# EAGLE design polar_bear (EAGLE 6.1)
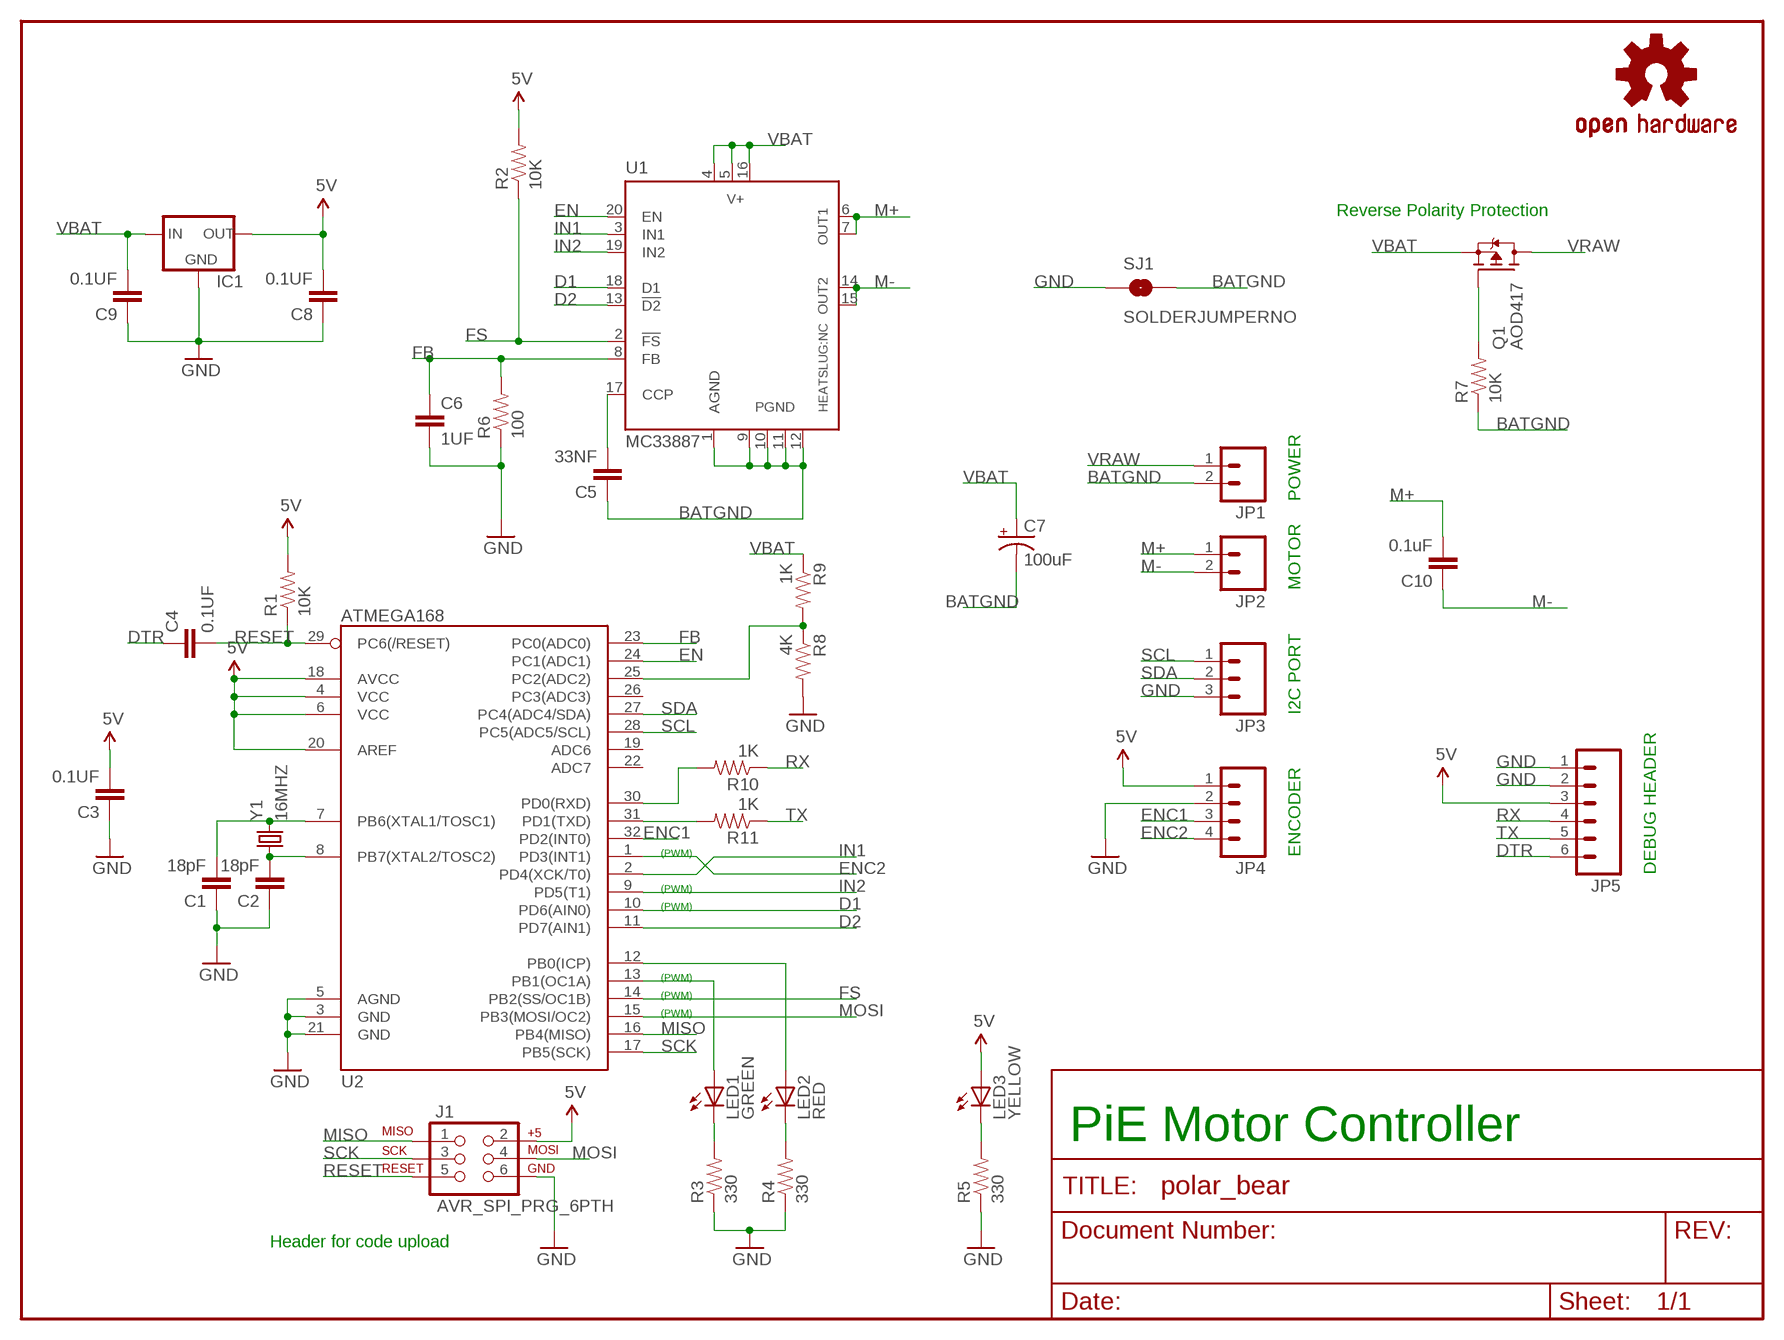
[diagram p0: schematic, sheet 1]

## Parts
C1  18pF  CAP0805  [0805]
C2  18pF  CAP0805  [0805]
C3  0.1UF  CAP0805  [0805]
C4  0.1UF  CAP0805  [0805]
C5  33NF  CAP0805  [0805]
C6  1UF  CAP0805  [0805]
C7  100uF  CAP_POLPTH1  [CPOL-RADIAL-100UF-25V]
C8  0.1UF  CAP0805  [0805]
C9  0.1UF  CAP0805  [0805]
C10  0.1uF  CAP0805  [0805]
IC1  V_REG_78XXTO-92  [TO-92]
J1  AVR_SPI_PRG_6PTH  [2X3]
JP1  M02PTH4  [1X02_XTRA_BIG]
JP2  M02PTH4  [1X02_XTRA_BIG]
JP3  M03POLAR  [MOLEX-1X3]
JP4  M04POLAR  [MOLEX-1X4]
JP5  M06SIP  [1X06]
LED1  GREEN  LED1206  [LED-1206]
LED2  RED  LED1206  [LED-1206]
LED3  YELLOW  LED1206  [LED-1206]
Q1  AOD417  [TO252]
R1  10K  RESISTOR0805-RES  [0805]
R2  10K  RESISTOR0805-RES  [0805]
R3  330  RESISTOR0805-RES  [0805]
R4  330  RESISTOR0805-RES  [0805]
R5  330  RESISTOR0805-RES  [0805]
R6  100  RESISTOR0805-RES  [0805]
R7  10K  RESISTOR0805-RES  [0805]
R8  4K  RESISTOR0805-RES  [0805]
R9  1K  RESISTOR0805-RES  [0805]
R10  1K  RESISTOR0805-RES  [0805]
R11  1K  RESISTOR0805-RES  [0805]
SJ1  SOLDERJUMPERNO  [SJ_2S-NO]
U1  MC33887  [HSOP-20]
U2  ATMEGA168  [TQFP32-08]
U$12  OSHW-LOGOS  [OSHW-LOGO-S]
Y1  16MHZ  CRYSTALHC49US  [HC49US]

## Nets
5V: C3.2 C8.2 IC1.3(OUT) J1.2 JP4.1 JP5.3 LED3.A R1.2 R2.2 U2.4(VCC) U2.6(VCC) U2.18(AVCC) U2.20(AREF)
BATGND: C5.1 C7.2(-) JP1.2 R7.1 SJ1.2 U1.1(AGND) U1.9(PGND) U1.10(PGND) U1.11(PGND) U1.12(PGND)
D1: U1.18(D1) U2.10(PD6(AIN0))
D2: U1.13(!D2) U2.11(PD7(AIN1))
DTR: C4.1 JP5.6
EN: U1.20(EN) U2.24(PC1(ADC1))
ENC1: JP4.3 U2.32(PD2(INT0))
ENC2: JP4.4 U2.1(PD3(INT1))
FB: C6.1 R6.2 U1.8(FB) U2.23(PC0(ADC0))
FS: R2.1 U1.2(!FS) U2.14(PB2(SS/OC1B))
GND: C1.1 C2.1 C3.1 C6.2 C8.1 C9.1 IC1.1(GND) J1.6 JP3.3 JP4.2 JP5.1 JP5.2 R3.1 R4.1 R5.1 R6.1 R8.2 SJ1.1 U2.3(GND) U2.5(AGND) U2.21(GND)
IN1: U1.3(IN1) U2.2(PD4(XCK/T0))
IN2: U1.19(IN2) U2.9(PD5(T1))
M+: C10.2 JP2.1 U1.6(OUT1) U1.7(OUT1)
M-: C10.1 JP2.2 U1.14(OUT2) U1.15(OUT2)
MISO: J1.1 U2.16(PB4(MISO))
MOSI: J1.4 U2.15(PB3(MOSI/OC2))
N$1: LED1.A U2.13(PB1(OC1A))
N$2: C2.2 U2.8(PB7(XTAL2/TOSC2)) Y1.1
N$3: C1.2 U2.7(PB6(XTAL1/TOSC1)) Y1.2
N$4: LED2.A U2.12(PB0(ICP))
N$5: LED1.C R3.2
N$6: LED2.C R4.2
N$7: C5.2 U1.17(CCP)
N$8: Q1.1(G) R7.2
N$9: LED3.C R5.2
N$10: R8.1 R9.2 U2.25(PC2(ADC2))
N$13: R11.2 U2.31(PD1(TXD))
N$14: R10.2 U2.30(PD0(RXD))
RESET: C4.2 J1.5 R1.1 U2.29(PC6(/RESET))
RX: JP5.4 R10.1
SCK: J1.3 U2.17(PB5(SCK))
SCL: JP3.1 U2.28(PC5(ADC5/SCL))
SDA: JP3.2 U2.27(PC4(ADC4/SDA))
TX: JP5.5 R11.1
VBAT: C7.1(+) C9.2 IC1.2(IN) Q1.2(S) R9.1 U1.4(V+) U1.5(V+) U1.16(V+)
VRAW: JP1.1 Q1.3(D)
Unconnected: U2.19(ADC6) U2.22(ADC7) U2.26(PC3(ADC3))

## Notes on the sheet
- Reverse Polarity Protection
- POWER
- MOTOR
- I2C PORT
- (PWM) | ENCODER
- DEBUG HEADER
- (PWM)
- (PWM)
- (PWM)
- (PWM)
- (PWM)
- PiE Motor Controller
- Header for code upload

## Library data of the parts
C1-C6 C8-C10 = SparkFun:CAP: Capacitor Standard 0603 ceramic capacitor, and 0.1" leaded capacitor.
C7 = SparkFun:CAP_POL: Capacitor Polarized These are standard SMD and PTH capacitors. Normally 10uF, 47uF, and 100uF in electrolytic and tantalum varieties. Always verify the external diameter of the through hole cap, it varies with capacity, voltage, and manufacturer. The EIA devices should be standard.
IC1 = SparkFun:V_REG_78XX: Voltage Regulator Standard 7805 5V regulator. IGO (Input Ground Output). Spark Fun Electronics SKU : COM-00107
J1 = SparkFun:AVR_SPI_PRG_6: AVR ISP 6 Pin This is the reduced ISP connector for AVR programming. Common on Arduino. This footprint will take up less PCB space and can be used with a 10-pin to 6-pin adapter such as SKU: BOB-08508
JP1 JP2 = SparkFun:M02: Header 2 Standard 2-pin 0.1" header. Use with straight break away headers (SKU : PRT-00116), right angle break away headers (PRT-00553), swiss pins (PRT-00743), machine pins (PRT-00117), and female headers (PRT-00115). Molex polarized connector foot print use with SKU : PRT-08233 with associated crimp pins and housings.
JP3 = SparkFun:M03: Header 3 Standard 3-pin 0.1" header. Use with straight break away headers (SKU : PRT-00116), right angle break away headers (PRT-00553), swiss pins (PRT-00743), machine pins (PRT-00117), and female headers (PRT-00115). Molex polarized connector foot print use with SKU : PRT-08232 with associated crimp pins and housings.
JP4 = SparkFun:M04: Header 4 Standard 4-pin 0.1" header. Use with straight break away headers (SKU : PRT-00116), right angle break away headers (PRT-00553), swiss pins (PRT-00743), machine pins (PRT-00117), and female headers (PRT-00115). Molex polarized connector foot print use with SKU : PRT-08231 with associated crimp pins and housings. 1MM SMD Version SKU: PRT-10208
JP5 = SparkFun:M06: Header 6 Standard 6-pin 0.1" header. Use with straight break away headers (SKU : PRT-00116), right angle break away headers (PRT-00553), swiss pins (PRT-00743), machine pins (PRT-00117), and female headers (PRT-00115). Molex polarized connector foot print use with SKU : PRT-08094 with associated crimp pins and housings. NOTES ON THE VARIANTS LOCK and LOCK_LONGPADS... This footprint was designed to help hold the alignment of a through-hole component (i.e. 6-pin header) while soldering it into place. You may notice that each hole has been shifted either up or down by 0.005 of an inch from it's more standard position (which is a perfectly straight line). This slight alteration caused the pins (the squares in the middle) to touch the edges of the holes. Because they are alternating, it causes a "brace" to hold the component in place. 0.005 has proven to be the perfect amount of "off-center" position when using our standard breakaway headers. Although looks a little odd when you look at the bare footprint, once you have a header in there, the alteration is very hard to notice. Also, if you push a header all the way into place, it is covered up entirely on the bottom side. This idea of altering the position of holes to aid alignment will be further integrated into the Sparkfun Library for other footprints. It can help hold any component with 3 or more connection pins.
LED1-LED3 = SparkFun:LED: LEDs Standard schematic elements and footprints for 5mm, 3mm, 1206, and 0603 sized LEDs. 5mm - Spark Fun Electronics SKU : COM-00529 (and others)
Q1 = transistor-fet:AOD417
R1-R11 = SparkFun:RESISTOR: Resistor Basic schematic elements and footprints for 0603, 1206, and PTH resistors.
SJ1 = SparkFun:SOLDERJUMPER: Solder Jumper Standard SMD solder jumper. Used to automate production. Two varients : Normally Open and Normally Closed are the same, but have different paste layers. NC will have a large amount of paste and should jumper during reflow.
U1 = pie:MC33887: 5.0A H-Bridge with Load Current Feedback Source: http://www.freescale.com/files/analog/doc/data_sheet/MC33887.pdf
U2 = SparkFun:ATMEGA168
U$12 = SparkFun:OSHW-LOGO: Open Source Hardware Logo This logo indicates the piece of hardware it is found on incorporates a OSHW license and/or adheres to the definition of open source hardware found here: http://freedomdefined.org/OSHW
Y1 = SparkFun:CRYSTAL: Crystals Various standard crystals. Proven footprints. Spark Fun Electronics SKU : COM-00534

## Board
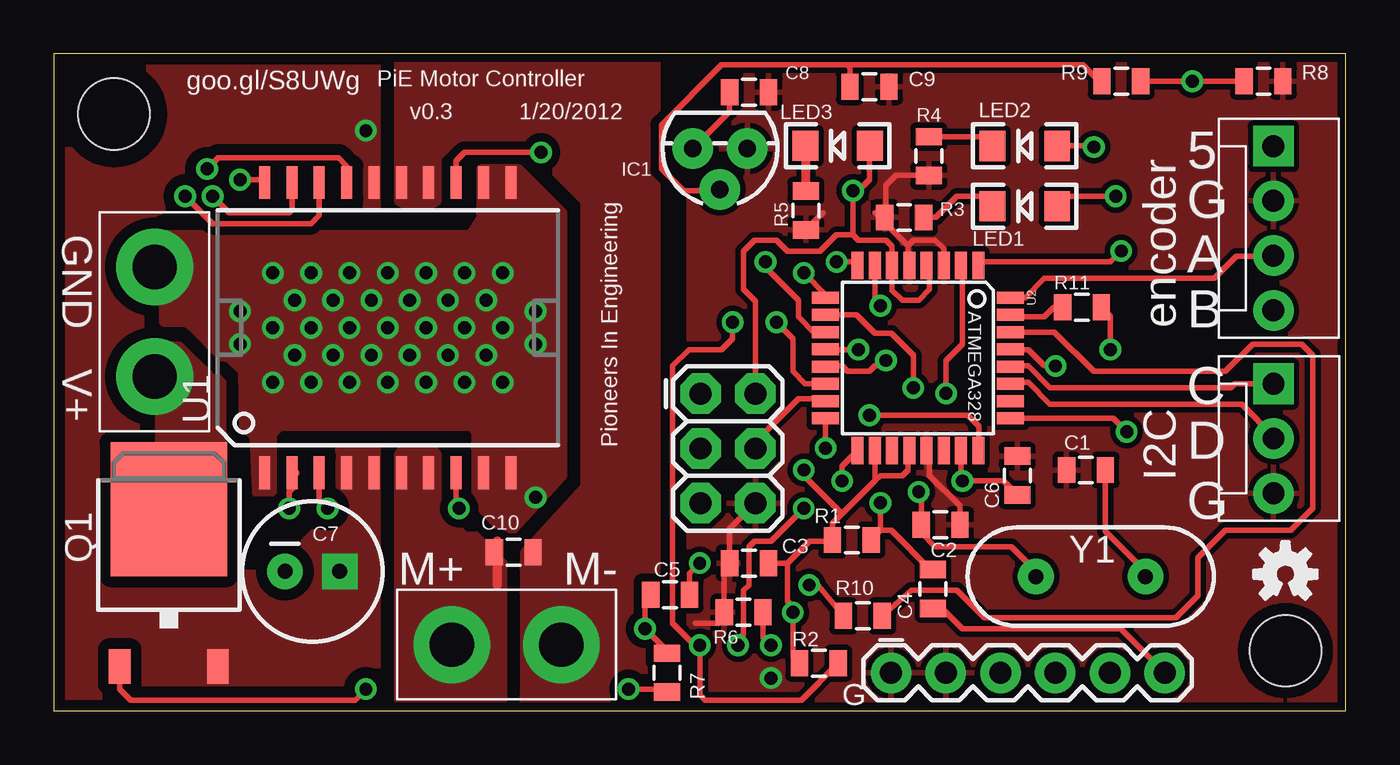
[diagram p1: board, top side]
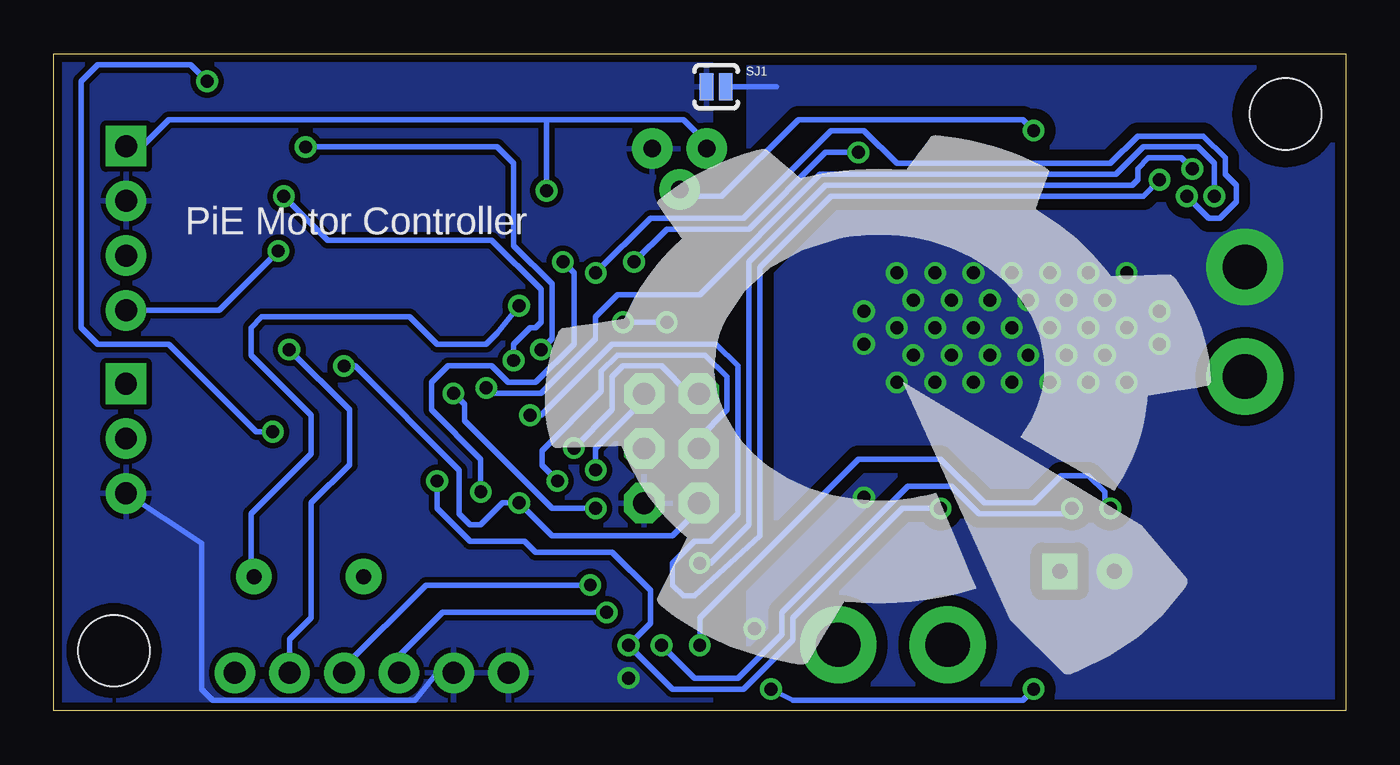
[diagram p2: board, bottom side, seen from below]

Size 59.94 x 30.48 mm. Coordinates in mm from the lower left corner, seen from the top.
Outline: 0,0 59.94,0 59.94,30.48 0,30.48 0,0
Copper layers (1*16): Top 0.035559375mm / dielectric 1.501140625mm / Bottom 0.035559375mm
Design rules: minimum track width 10mil, minimum drill 15mil, track to track 6mil, track to pad 6mil, pad to pad 6mil, via to via 6mil, smd to smd 6mil, copper to edge 15mil, drill to drill 8mil, minimum pad ring 10mil, minimum via ring 8mil, stop-mask expansion 4mil, vias tented up to drill 0mil, thermal gap 10mil

### Footprints (pad centres in the part's own frame; a part is rotated, then mirrored left to right if it is on the bottom)
0805 = smd 0.8 x 1.2: 1 -0.9,0; 2 0.9,0
CPOL-RADIAL-100UF-25V = drill 0.7 pad 1.651 square: 1 1.27,0 | drill 0.7 pad 1.651: 2 -1.27,0
TO-92 = drill 0.813 pad 1.88: 1 -1.27,0; 2 0,1.905; 3 1.27,0
2X3 = drill 1.016 pad 1.88 octagon: 1 0,0; 2 0,2.54; 3 2.54,0; 4 2.54,2.54; 5 5.08,0; 6 5.08,2.54
1X02_XTRA_BIG = drill 2.057 pad 3.556: 1 -2.54,0; 2 2.54,0
MOLEX-1X3 = drill 1.016 pad 1.88 square: 1 0,0 | drill 1.016 pad 1.88: 2 2.54,0; 3 5.08,0
MOLEX-1X4 = drill 1.016 pad 1.88 square: 1 0,0 | drill 1.016 pad 1.88: 2 2.54,0; 3 5.08,0; 4 7.62,0
1X06 = drill 1.016 pad 1.88: 1 0,0; 2 2.54,0; 3 5.08,0; 4 7.62,0; 5 10.16,0; 6 12.7,0
LED-1206 = smd 1.2 x 1.4: A -1.5,0; C 1.5,0
TO252 = smd 1 x 1.6: 1 -2.28,-4.8; 2 2.28,-4.8 | smd 5.4 x 6.2: 3 0,2.5
SJ_2S-NO = smd 0.635 x 1.27: 1 -0.45,0; 2 0.45,0
HSOP-20 = smd 0.508 x 1.524: 1 -5.715,-6.731; 2 -4.445,-6.731; 3 -3.175,-6.731; 4 -1.905,-6.731; 5 -0.635,-6.731; 6 0.635,-6.731; 7 1.905,-6.731; 8 3.175,-6.731; 9 4.445,-6.731; 10 5.715,-6.731; 11 5.715,6.731; 12 4.445,6.731; 13 3.175,6.731; 14 1.905,6.731; 15 0.635,6.731; 16 -0.635,6.731; 17 -1.905,6.731; 18 -3.175,6.731; 19 -4.445,6.731; 20 -5.715,6.731
TQFP32-08 = smd 1.27 x 0.559: 1 -4.293,2.8; 2 -4.293,2; 3 -4.293,1.2; 4 -4.293,0.4; 5 -4.293,-0.4; 6 -4.293,-1.2; 7 -4.293,-2; 8 -4.293,-2.8; 17 4.293,-2.8; 18 4.293,-2; 19 4.293,-1.2; 20 4.293,-0.4; 21 4.293,0.4; 22 4.293,1.2; 23 4.293,2; 24 4.293,2.8 | smd 0.559 x 1.27: 9 -2.8,-4.293; 10 -2,-4.293; 11 -1.2,-4.293; 12 -0.4,-4.293; 13 0.4,-4.293; 14 1.2,-4.293; 15 2,-4.293; 16 2.8,-4.293; 25 2.8,4.293; 26 2,4.293; 27 1.2,4.293; 28 0.4,4.293; 29 -0.4,4.293; 30 -1.2,4.293; 31 -2,4.293; 32 -2.8,4.293
STAND-OFF = hole 3.302: 0,0
HC49US = drill 0.7 pad 1.651: 1 -2.54,0; 2 2.54,0

### Placement (x,y rotation side)
C1  47.89,11.18 0 top
C2  41.15,8.64 180 top
C3  32.26,6.86 0 top
C4  40.79,5.66 90 top
C5  28.6,5.39 0 top
C6  44.7,10.92 90 top
C7  11.99,6.48 0 top
C8  32.26,28.7 180 top
C9  37.85,28.96 180 top
C10  21.34,7.37 180 top
IC1  30.91,26.09 180 top
J1  30.01,14.72 270 top
JP1  4.68,18.06 90 top
JP2  21.01,3.07 0 top
JP3  56.6,15.18 270 top
JP4  56.59,26.2 270 top
JP5  38.85,1.77 0 top
LED1  45.05,23.42 180 top
LED2  45.05,26.21 180 top
LED3  36.37,26.22 180 top
Q1  5.33,6.86 0 top
R1  37.03,7.93 180 top
R2  35.5,2.21 180 top
R3  39.46,22.89 0 top
R4  40.6,25.74 90 top
R5  34.9,23.22 90 top
R6  32,4.57 0 top
R7  28.45,1.78 270 top
R8  56.13,29.21 0 top
R9  49.53,29.21 0 top
R10  37.54,4.41 0 top
R11  47.71,18.73 180 top
SJ1  29.21,28.96 0 bottom
U1  15.49,17.78 0 top
U2  40.1,16.37 270 top
U$3  [STAND-OFF]  57.15,2.79 0 top
U$11  [STAND-OFF]  2.79,27.69 0 top
U$12  57.15,6.35 0 top
Y1  48.11,6.23 0 top

### Tracks (layer width: path | path; a pad name or v marks a point on that pad's centre or on a via)
5V  (via drill 0.6)
  Top 0.254: 34.04,6.86 C3.2 | 34.04,6.86 35.05,7.87 36.08,7.87 | 37.85,26.2 37.85,24.64 37.34,24.13 v37.08,24.13 37.08,22.1 | R1.2 36.13,8.7 36.58,9.14 | 36.58,9.14 38.1,10.67 | 38.1,10.67 U2.18 | 38.1,10.67 | U2.20 39.62,12.01 39.62,11.18 39.37,10.92 38.35,10.92 38.1,10.67 | 37.08,22.1 37.34,21.84 38.61,21.84 38.9,21.56 U2.6 38.9,19.52 39.37,19.05 40.13,19.05 40.64,19.56 40.64,20.52 U2.4 | 37.08,22.1 36.32,22.1 35.56,21.34 34.04,21.34 33.53,21.84 32.51,21.84 32,21.34 32,19.56 32.55,19.01 J1.2 | v34.29,4.57 34.04,4.32 | v34.29,4.57 34.29,4.83 34.04,5.08 34.04,6.86 | R2.2 34.29,2.52 v34.29,4.57 | v34.8,11.18 34.8,10.92 36.58,9.14 | C8.2 31.36,27.8 IC1.3
  Top 0.406: 36.08,7.87 R1.2 | 37.85,26.2 LED3.A
  Bottom 0.254: IC1.3 29.64,26.34 30.73,27.43 37.08,27.43 | JP5.3 43.93,2.55 41.91,4.57 v34.29,4.57 | J1.2 32.55,14.44 34.8,12.19 v34.8,11.18 | JP4.1 55.84,26.2 54.61,27.43 37.08,27.43 | v37.08,24.13 37.08,27.43
BATGND  (via drill 0.6)
  Top 0.254: 27.94,5.15 C5.1 27.7,5.35 27.69,5.33 | 27.69,5.33 27.69,5.59 | R7.1 28.45,2.79 v27.43,3.81 27.43,5.08 27.69,5.33
  Bottom 0.254: SJ1.2 26.42,28.96
  other vias: 22.35,9.91 8.64,18.54 8.64,17.02 10.16,17.78 11.94,17.78 13.72,17.78 15.49,17.78 17.27,17.78 19.05,17.78 20.83,17.78 22.35,17.02 22.35,18.54 11.18,19.05 12.95,19.05 14.73,19.05 16.51,19.05 18.29,19.05 20.07,19.05 10.16,20.32 11.94,20.32 13.72,20.32 15.49,20.32 17.27,20.32 19.05,20.32 20.83,20.32 11.18,16.51 12.95,16.51 14.73,16.51 16.51,16.51 18.29,16.51 20.07,16.51 10.16,15.24 11.94,15.24 13.72,15.24 15.49,15.24 17.27,15.24 19.05,15.24 20.83,15.24
  pour Top (isolate 0.381, no thermals): 5.08,18.03 6.1,18.03 6.35,17.86 7.77,16.42 8.1,16.4 8.73,15.76 8.79,13.24 9.28,12.75 9.4,10.14 10.16,10.16 10.16,12.85 10.52,13.21 19.3,13.21 19.56,12.95 19.56,9.65 21.08,8.13 23.62,10.92 23.62,23.11 21.59,25.15 19.81,25.15 19.81,22.86 19.3,22.1 5.08,22.1
  pour Bottom (isolate 0.508, no thermals): -0.25,31.5 27.69,31.5 27.69,-0.51 -0.25,-0.51
D1  (via drill 0.6)
  Top 0.254: U2.10 37.25,18.37 38.1,17.53 38.86,17.53 39.88,16.51 v39.88,14.99 | 12.32,24.77 U1.18 12.32,22.99 11.94,22.61 7.37,22.61 v6.1,23.88
  Bottom 0.254: v39.88,14.99 39.62,14.73 37.34,14.73 34.8,17.27 34.8,18.29 33.78,19.3 29.97,19.3 24.38,24.89 10.67,24.89 9.4,26.16 6.86,26.16 6.1,25.4 v6.1,23.88
D2  (via drill 0.6)
  Top 0.254: U2.11 35.76,17.53 35.31,17.53 34.54,18.29 34.54,19.05 33.02,20.57 v33.02,20.83 | v22.61,25.91 19.05,25.91 18.67,25.53 U1.13
  Bottom 0.254: v33.02,20.83 31.5,22.35 27.69,22.35 24.13,25.91 v22.61,25.91
DTR
  Top 0.254: C4.1 40.86,4.83 41.15,4.83 42.16,3.81 49.51,3.81 JP5.6
EN  (via drill 0.6)
  Top 0.254: v37.85,13.72 42.42,13.72 42.93,13.21 42.93,12.11 U2.24 | v8.64,24.64 9.65,24.64 U1.20
  Bottom 0.254: v37.85,13.72 37.34,13.72 34.04,17.02 29.21,17.02 28.19,16 28.19,9.14 29.46,7.87 30.23,7.87 31.24,6.86 31.24,5.84 30.73,5.33 30.23,5.33 27.18,8.13 27.18,20.57 23.88,23.88 9.4,23.88 v8.64,24.64
ENC1
  Top 0.254: U2.32 45.08,19.17 45.97,20.07 53.85,20.07 54.86,21.08 56.55,21.08 JP4.3
ENC2  (via drill 0.6)
  Top 0.254: v49.53,21.34 49.02,20.83 42.93,20.83 42.93,20.57 42.9,20.6 U2.1
  Bottom 0.254: JP4.4 52.28,18.58 v49.53,21.34
FB  (via drill 0.6)
  Top 0.254: U2.23 42.1,10.74 v42.16,10.67 44.06,10.67 C6.1 | U1.8 18.67,9.53 v18.8,9.4 | R6.2 32.9,3.42 v33.27,3.05
  Bottom 0.254: v42.16,10.67 42.16,9.4 40.64,7.87 38.1,7.87 37.59,7.37 34.04,7.37 32.26,5.59 32.26,4.06 v33.27,3.05 31.24,1.02 27.94,1.02 25.65,3.3 25.65,4.32 20.57,9.4 v18.8,9.4
FS  (via drill 0.6)
  Top 0.254: U2.14 34.86,15.17 34.29,15.75 34.29,17.27 v33.53,18.03 | v31.5,18.03 31.5,17.27 30.99,16.76 29.46,16.76 28.7,16 28.7,4.06 29.72,3.05 v29.97,3.05 29.97,0.76 30.23,0.51 34.69,0.51 R2.1 | 11.18,11.05 11.18,10.41 10.92,10.16 v10.92,9.4
  Top 0.406: 11.18,11.05 U1.2
  Bottom 0.254: v31.5,18.03 v33.53,18.03 | v29.97,3.05 29.97,4.32 22.61,11.68 18.8,11.68 16.76,9.65 14.48,9.65 13.21,10.92 11.94,10.92 11.18,10.16 11.18,9.65 v10.92,9.4
GND  (via drill 0.6)
  Top 0.254: 29.77,4.06 30.85,4.06 R6.1 31.1,6.6 C3.1 31.36,8.44 J1.6 | 42.05,9.4 42.05,9.51 40.64,10.92 40.64,11.94 U2.21 | 42.05,9.4 C2.1 | 42.05,9.4 42.05,8.89 | 34.93,22.35 R5.1 35.69,23.11 | R3.1 38.61,22.94 38.61,24.38 39.07,24.84 R4.1 40.9,24.89 | R3.1 38.56,22.66 39.62,21.59 | 39.62,21.59 39.62,20.74 U2.5 | R3.1 38.32,22.89 38.1,23.11 | U2.3 41.3,21.44 40.89,21.84 39.88,21.84 39.62,21.59
  Bottom 0.254: JP5.2 42.17,1.77 43.18,0.51 52.58,0.51 53.09,1.02 53.09,7.77 JP3.3
  other vias: 33.27,1.52
  pour Top (isolate 0.254): 29.46,32 60.96,32 60.96,-0.25 29.46,-0.25
  pour Bottom (isolate 0.254): 29.46,32 60.96,32 60.96,-0.51 29.46,-0.51
IN1  (via drill 0.6)
  Top 0.254: U1.3 12.32,9.78 v12.7,9.4 | v34.8,9.4 33.27,7.87 32.51,7.87 32.26,7.62 32.26,5.84 32,5.59 32,3.56 31.75,3.3 v31.75,3.05 | v41.4,14.73 41.4,16.26 42.16,17.02 42.16,20.6 U2.2
  Bottom 0.254: v12.7,9.4 12.95,9.14 17.02,9.14 18.29,10.41 20.32,10.41 26.16,4.57 26.16,3.56 28.19,1.52 30.23,1.52 v31.75,3.05 | v34.8,9.4 36.83,9.4 40.89,13.46 40.89,14.22 v41.4,14.73
IN2  (via drill 0.6)
  Top 0.254: U2.9 35.8,19.32 v34.8,20.32 | 11.18,24.64 U1.19 11.05,23.24 10.92,23.11 8.13,23.11 v7.37,23.88
  Bottom 0.254: v34.8,20.32 32.26,22.86 27.94,22.86 23.88,26.92 22.35,26.92 20.83,25.4 10.92,25.4 9.65,26.67 6.6,26.67 5.59,25.65 5.59,24.89 5.08,24.38 5.08,23.62 5.84,22.86 6.35,22.86 v7.37,23.88
M+
  Top 0.406: C10.2 20.57,7.87 20.57,5.84
  pour Top (isolate 0.381, no thermals): 20.83,0.51 16,0.51 16,11.94 16.26,12.19 17.53,12.19 17.78,11.94 17.78,9.4 19.05,8.13 19.56,8.13 20.83,6.86
M-
  pour Top (isolate 0.381, no thermals): 21.84,0.25 21.84,7.37 24.64,10.41 24.64,23.62 22.1,26.16 18.29,26.16 17.78,25.65 17.78,23.62 17.27,23.37 16.51,23.37 16,23.62 16,30.48 27.94,30.48 27.94,6.86 27.69,0.25
MISO  (via drill 0.6)
  Top 0.254: v35.81,12.19 35.81,13.56 U2.16
  Bottom 0.254: J1.1 30.46,14.72 31.75,16 33.53,16 34.04,15.49 34.04,13.97 v35.81,12.19
MOSI
  Top 0.254: J1.4 32.55,12.49 34.54,14.48 35.7,14.48 U2.15
N$1  (via drill 0.6)
  Top 0.254: v38.61,16.26 38.35,16 38.1,16 37.85,15.75 36.83,15.75 36.58,16 35.83,16 U2.13 | LED1.A 47.01,23.88 v49.28,23.88
  Bottom 0.254: v38.61,16.26 38.61,17.02 37.85,17.78 37.59,17.78 37.34,18.03 37.34,19.56 39.62,21.84 47.24,21.84 v49.28,23.88
N$2  (via drill 0.6)
  Top 0.254: v40.13,10.16 40.13,9.91 40.25,9.79 C2.2 40.25,8.27 40.89,7.62 44.44,7.62 45.57,6.49 Y1.1 | v36.32,20.83 37.13,20.83 U2.8
  Bottom 0.254: 36.07,20.57 v36.32,20.83 35.81,20.32 35.81,17.02 37.59,15.24 38.86,15.24 39.62,16 41.66,16 42.42,15.24 42.42,13.97 40.13,11.68 v40.13,10.16
N$3  (via drill 0.6)
  Top 0.254: v38.35,18.8 38.1,19.05 U2.7 | 50.8,6.63 Y1.2 50.65,6.49 48.79,8.35 C1.2
  Bottom 0.254: v38.35,18.8 39.37,17.53 39.88,17.02 42.16,17.02 43.43,18.29 50.29,18.29 50.8,17.78 50.8,16.51 48.01,13.72 48.01,11.94 50.8,9.14 50.8,6.63 Y1.2
N$4  (via drill 0.6)
  Top 0.254: LED2.A 48.21,26.21 v48.26,26.16 | v37.34,16.76 35.81,16.76 U2.12
  Bottom 0.254: v48.26,26.16 39.37,26.16 38.61,25.4 38.61,21.59 36.83,19.81 36.83,17.27 v37.34,16.76
N$5
  Top 0.254: R3.2 40.93,22.89 41.91,23.88 43.35,23.88 LED1.C
N$6
  Top 0.254: R4.2 43.38,26.64 LED2.C
N$7  (via drill 0.6)
  Top 0.254: C5.2 29.5,6.38 v29.97,6.86 | 13.46,24.64 U1.17 13.59,25.27 13.21,25.65 7.62,25.65 v7.11,25.15 7.11,24.89
  Bottom 0.254: v29.97,6.86 29.46,6.86 27.69,8.64 27.69,20.83 24.13,24.38 9.91,24.38 9.65,24.64 9.65,25.15 9.14,25.65 7.62,25.65 v7.11,25.15
N$8  (via drill 0.6)
  Top 0.254: v14.48,1.02 13.97,0.51 3.56,0.51 3.05,1.02 Q1.1 | v26.67,1.02 27.94,1.02 R7.2
  Top 0.406: Q1.1 3.05,2.03
  Bottom 0.254: v14.48,1.02 14.99,0.51 25.65,0.51 v26.67,1.02
N$9
  Top 0.406: R5.2 34.9,26.2 LED3.C
N$10  (via drill 0.6)
  Top 0.254: U2.25 49.16,13.57 v49.78,12.95 | R8.1 v52.83,29.21 R9.2
  Bottom 0.254: v49.78,12.95 50.55,12.95 54.61,17.02 57.91,17.02 58.67,17.78 58.67,29.21 57.91,29.97 53.59,29.97 v52.83,29.21
N$13
  Top 0.254: U2.31 44.48,18.29 45.97,18.29 46.42,18.73 R11.2
N$14
  Top 0.254: 44.44,17.53 U2.30 46.43,17.57 48.26,15.75 54.36,15.75 55.63,17.02 57.91,17.02 58.42,16.51 58.42,9.4 57.4,8.38 54.36,8.38 53.09,7.11 53.09,5.33 52.07,4.32 43.18,4.32 41.91,5.59 39.8,5.59 R10.2
RESET  (via drill 0.6)
  Top 0.254: v38.35,9.65 38.35,8.35 | 38.35,8.35 R1.1 | U2.29 45.21,16.76 45.97,16 v46.48,16 | C4.2 40.69,6.56 38.86,8.38 38.39,8.38 38.35,8.35
  Bottom 0.254: J1.5 30.01,9.36 31.24,8.13 36.83,8.13 v38.35,9.65 39.12,9.65 40.13,8.64 40.64,8.64 41.15,9.14 41.15,11.18 45.97,16 v46.48,16
RX  (via drill 0.6)
  Top 0.254: v35.05,5.84 35.46,5.84 R10.1
  Bottom 0.254: JP5.4 46.47,2.05 42.67,5.84 v35.05,5.84
SCK  (via drill 0.6)
  Top 0.254: v36.58,10.67 36.58,11.36 U2.17
  Bottom 0.254: J1.3 30.01,12.66 28.7,13.97 28.7,15.49 29.72,16.51 33.78,16.51 34.54,15.75 34.54,14.83 U2.17 37.3,11.39 v36.58,10.67
SCL
  Top 0.254: 44.42,15.94 U2.28 44.42,16 45.21,16 46.23,14.99 54.61,14.99 54.8,15.18 JP3.1
SDA
  Top 0.254: U2.27 44.45,15.24 45.21,15.24 46.23,14.22 55.12,14.22 56.64,12.7 56.6,12.66 JP3.2
TX  (via drill 0.6)
  Top 0.254: R11.1 49.02,18.31 v49.02,16.76
  Bottom 0.254: JP5.5 49.01,3.32 48.01,4.32 48.01,9.65 46.23,11.43 46.23,13.97 v49.02,16.76
VBAT  (via drill 0.6)
  Top 0.254: 30.96,24.13 29.21,24.13 28.19,25.15 28.19,27.18 30.99,29.97 36.83,29.97 | 36.83,29.97 47.75,29.97 48.51,29.21 R9.1 | C9.2 36.95,29.86 36.83,29.97 | 30.99,24.13 30.96,24.13 | 30.96,24.13 IC1.2
  Bottom 0.254: v14.48,26.92 14.99,27.43 25.4,27.43 28.96,23.88 30.86,23.88 IC1.2
  pour Top (isolate 0.508, no thermals): 14.48,25.4 14.48,23.37 14.99,23.37 14.99,31.5 -1.02,31.5 -1.27,0.76 -1.27,0 14.99,0 14.99,12.19 13.21,12.19 13.21,9.4 10.16,6.35 3.81,6.35 4.06,22.86 6.61,23.94 8.91,25.91
VRAW
  Top 0.254: 7.8,9.14 7.62,9.14 7.41,9.36 Q1.3
  pour Top (no thermals): 4.83,17.02 4.83,11.43 5.59,10.67 7.37,10.67 7.87,11.43 7.87,15.24 7.62,15.49 7.37,15.49 5.84,17.02

### Text on the board
tPlace: goo.gl/S8UWg | PiE Motor Controller | 1/20/2012 | v0.3 | 5 | Pioneers In Engineering | G | GND | A | ATMEGA328 | encoder | B | V+ | C | D | I2C | G | M+ | M- | G
bPlace: PiE Motor Controller
tDocu: ICSP HEADER | FTDI HEADER